# Altium project STB_ValidationBoard.PrjPcb (part 2 of 2)

## Sheet STB_UID.SchDoc: STB Validation Board - UID
size A4; Author: mayerph; DrawnBy: mayerph; Organization: PBL; Revision: A; SheetNumber: 4; SheetTotal: 4
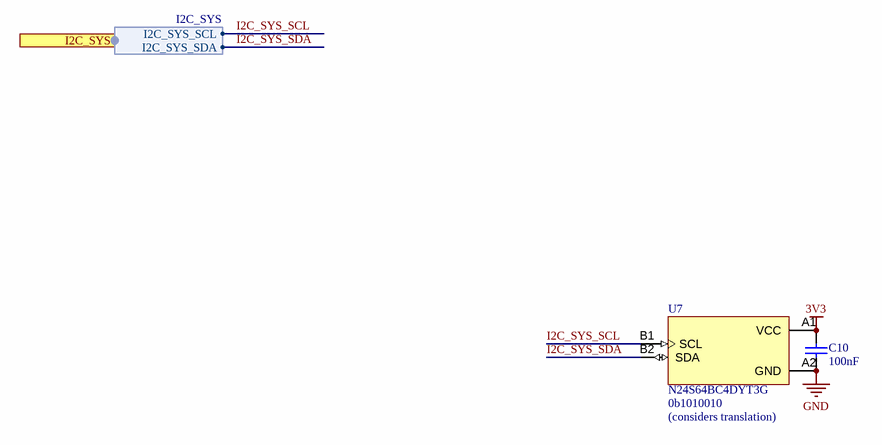
[diagram p2: STB_UID.SchDoc]

### Parts
C10  100nF  [CAPC1050X55X23LL05T13]
U7  N24S64BC4DYT3G  [4-WLCSP (0.77x0.77)]

### Ports
I2C_SYS (harness I2C_SYS, see STB_ValidationBoard[6A], STB_Sensors[1A], STB_Spectrometer[1B])

### Harnesses
I2C_SYS: I2C_SYS_SDA, I2C_SYS_SCL

### Nets
3V3: C10.2 U7.A1(VCC)
GND: C10.1 U7.A2(GND)
I2C_SYS_SCL: U7.B1(SCL) ; port I2C_SYS.I2C_SYS_SCL
I2C_SYS_SDA: U7.B2(SDA) ; port I2C_SYS.I2C_SYS_SDA

### Notes on the sheet
- (near U7) 0b1010010
- (considers translation)
- 1
- 2
- 3
- 4
- A
- B
- C
- Project:
- D
- Date:
- Drawing number:
- Rev:
- Format:
- A4 Q
- Drawn by:
- Laboratory:
- Page
- Sheet:
- of
- File:

### Library data of the parts
C10 = CMP-2000-05439-1: Chip Capacitor, 100 nF, +/- 10%, 16 V, -55 to 125 degC, 0402 (1005 Metric), RoHS, Tape and Reel; Manufacturer: Samsung Electro-Mechanics; Manufacturer Part Number: CL05B104KO5NNNC; Dielectric: X7R; Rated Voltage: 16V; Dielectric Material: Ceramic; Multilayer: Yes; Case Size/Dimension: 0402; Tolerance (%): ±10%; Value: 100nF; Manufacturer URL: http://www.samsungsem.com/global/index.jsp; Datasheet URL: https://datasheet.ciiva.com/29198/458718-da-01-en-vs-kondensator-0402-29198423.pdf; Datasheet Version: Nov-10; Supplier 1: Digi-Key; Supplier Part Number 1: 1276-1001-6-ND; RoHS: Yes; Category: Ceramic Capacitors; Stock 1: 24854634; Pricing 1: 1=0.10000, 10=0.02400, 50=0.01300, 100=0.01050, 500=0.00752, 1000=0.00592, 2500=0.00538, 5000=0.00495 (USD); Mount: Surface Mount; Number of Pins: 2; Package Shape: Rectangular; Size Code: 0402; Terminal Finish: Nickel; Min Operating Temperature: -55°C; Max Operating Temperature: 125°C; JESD-609 Code: e3; Capacitor Type: Ceramic; Negative Tolerance: 10%; Packaging: Tape and Reel; Positive Tolerance: 10%; Rated DC Voltage (URdc): 16V; Temperature Characteristics Code: X7R; Termination: Wraparound; Package Style: SMTMeter; Length: 1mm; Width: 0.5mm; Height: 0.55mm; REACH SVHC: Yes; RoHS Compliant: Yes; ComponentLink1URL: https://datasheet.ciiva.com:443/pdfs/VipMasterIC/IC/SEMS/SEMS-S-A0008384515/SEMS-S-A0008872921-1.pdf?src-supplier=IHS+Markit; ComponentLink1Description: https://datasheet.ciiva.com:443/pdfs/VipMasterIC/IC/SEMS/SEMS-S-A0008384515/SEMS-S-A0008872921-1.pdf?src-supplier=IHS+Markit; ComponentLink2URL: https://datasheet.ciiva.com/26920/getdatasheetpartid-359683-26920169.pdf?src-supplier=Verical; ComponentLink2Description: https://datasheet.ciiva.com/26920/getdatasheetpartid-359683-26920169.pdf?src-supplier=Verical; ComponentLink3URL: https://datasheet.ciiva.com/29198/458718-da-01-en-vs-kondensator-0402-29198423.pdf?src-supplier=Conrad; ComponentLink3Description: https://datasheet.ciiva.com/29198/458718-da-01-en-vs-kondensator-0402-29198423.pdf?src-supplier=Conrad; ComponentLink4URL: https://datasheet.ciiva.com/26309/mlcc-catalogdownload2013-eng-26309003.pdf?src-supplier=Distrelec; ComponentLink4Description: https://datasheet.ciiva.com/26309/mlcc-catalogdownload2013-eng-26309003.pdf?src-supplier=Distrelec; ComponentLink5URL: https://datasheet.ciiva.com/16208/cl05b104kq5nnnc-16208343.pdf?src-supplier=Future+Electronics; ComponentLink5Description: https://datasheet.ciiva.com/16208/cl05b104kq5nnnc-16208343.pdf?src-supplier=Future+Electronics
U7 = CMP-02089-1: Memory IC 64Kb (8K x 8) I²C 1 MHz 400 ns 4-WLCSP (0.77x0.77); Mfr: onsemi; Manufacturer: ON Semiconductor; Product Status: Active; Memory Type: Non-Volatile; Memory Format: EEPROM; Clock Frequency: 1 MHz; Write Cycle Time - Word, Page: 5ms; Access Time: 400 ns; Voltage - Supply: 1.7V ~ 5.5V; Base Product Number: N24S64; Technology: -; Memory Size: 64Kb (8K x 8); Memory Interface: I²C; Operating Temperature: -40°C ~ 85°C (TA); Mounting Type: Surface Mount; Package / Case: 4-XFBGA, WLCSP; Supplier Device Package: 4-WLCSP (0.77x0.77); Supplier 1: Digi-Key; Supplier Part Number 1: 488-N24S64BC4DYT3GDKR-ND; Manufacturer Part Number: N24S64BC4DYT3G; RoHS: Yes; Category: EEPROM

## Sheet STB_Sensors.SchDoc: STB Validation Board - Sensor
size A4; Author: mayerph; DrawnBy: mayerph; Organization: PBL; Revision: A; SheetNumber: 2; SheetTotal: 4
Used 64 times, as channels S1, S2, S3, S4, S5, S6, S7, S8, S9, S10, S11, S12, S13, S14, S15, S16, S17, S18, S19, S20, S21, S22, S23, S24, S25, S26, S27, S28, S29, S30, S31, S32, S33, S34, S35, S36, S37, S38, S39, S40, S41, S42, S43, S44, S45, S46, S47, S48, S49, S50, S51, S52, S53, S54, S55, S56, S57, S58, S59, S60, S61, S62, S63, S64. Parts and nets are listed once, with the designators drawn on the sheet.
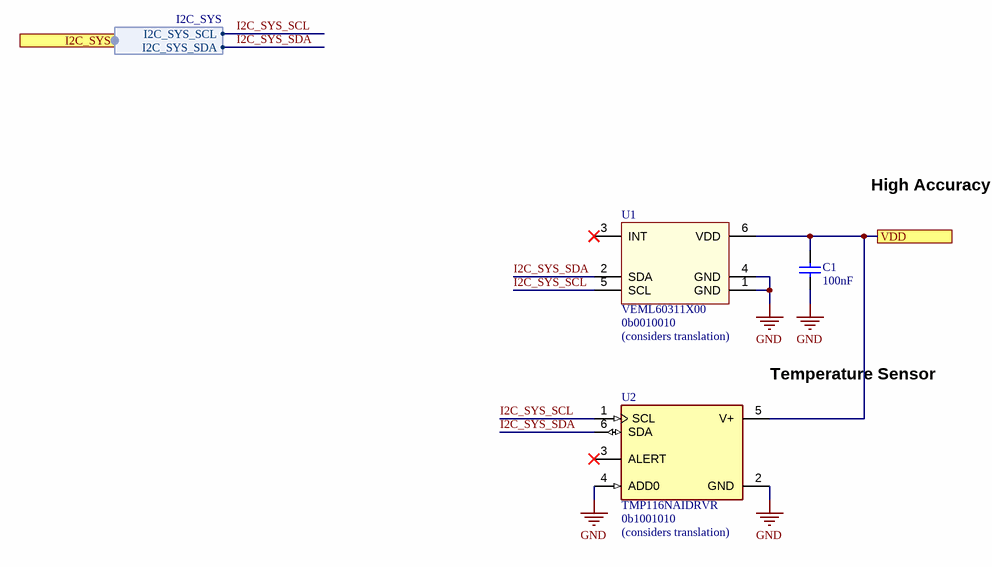
[diagram p3: STB_Sensors.SchDoc]

### Parts
C1  100nF  [CAPC1050X55X23LL05T13]
U1  VEML60311X00  [6-SMD - No Thermal Pad_2]
U2  TMP116NAIDRVR  Address: 0b1001010  [FP-DRV0006B-MFG]

### Ports
I2C_SYS (harness I2C_SYS, see STB_ValidationBoard[6B], STB_Spectrometer[1B], STB_UID[1A]), VDD (see STB_ValidationBoard[6B])

### Harnesses
I2C_SYS: I2C_SYS_SDA, I2C_SYS_SCL

### Nets
GND: C1.1 U1.1(GND) U1.4(GND) U2.2(GND) U2.4(ADD0)
I2C_SYS_SCL: U1.5(SCL) U2.1(SCL) ; port I2C_SYS.I2C_SYS_SCL
I2C_SYS_SDA: U1.2(SDA) U2.6(SDA) ; port I2C_SYS.I2C_SYS_SDA
VDD: C1.2 U1.6(VDD) U2.5(V+) ; port VDD

Not connected (* = marked no-connect by the designer): U1 3(INT)*; U2 3(ALERT)*

### Channels
S1: designators end in _S1; ports VDD=VDD1
S2: designators end in _S2; ports VDD=VDD2
S3: designators end in _S3; ports VDD=VDD3
S4: designators end in _S4; ports VDD=VDD4
S5: designators end in _S5; ports VDD=VDD5
S6: designators end in _S6; ports VDD=VDD6
S7: designators end in _S7; ports VDD=VDD7
S8: designators end in _S8; ports VDD=VDD8
S9: designators end in _S9; ports VDD=VDD9
S10: designators end in _S10; ports VDD=VDD10
S11: designators end in _S11; ports VDD=VDD11
S12: designators end in _S12; ports VDD=VDD12
S13: designators end in _S13; ports VDD=VDD13
S14: designators end in _S14; ports VDD=VDD14
S15: designators end in _S15; ports VDD=VDD15
S16: designators end in _S16; ports VDD=VDD16
S17: designators end in _S17; ports VDD=VDD17
S18: designators end in _S18; ports VDD=VDD18
S19: designators end in _S19; ports VDD=VDD19
S20: designators end in _S20; ports VDD=VDD20
S21: designators end in _S21; ports VDD=VDD21
S22: designators end in _S22; ports VDD=VDD22
S23: designators end in _S23; ports VDD=VDD23
S24: designators end in _S24; ports VDD=VDD24
S25: designators end in _S25; ports VDD=VDD25
S26: designators end in _S26; ports VDD=VDD26
S27: designators end in _S27; ports VDD=VDD27
S28: designators end in _S28; ports VDD=VDD28
S29: designators end in _S29; ports VDD=VDD29
S30: designators end in _S30; ports VDD=VDD30
S31: designators end in _S31; ports VDD=VDD31
S32: designators end in _S32; ports VDD=VDD32
S33: designators end in _S33; ports VDD=VDD33
S34: designators end in _S34; ports VDD=VDD34
S35: designators end in _S35; ports VDD=VDD35
S36: designators end in _S36; ports VDD=VDD36
S37: designators end in _S37; ports VDD=VDD37
S38: designators end in _S38; ports VDD=VDD38
S39: designators end in _S39; ports VDD=VDD39
S40: designators end in _S40; ports VDD=VDD40
S41: designators end in _S41; ports VDD=VDD41
S42: designators end in _S42; ports VDD=VDD42
S43: designators end in _S43; ports VDD=VDD43
S44: designators end in _S44; ports VDD=VDD44
S45: designators end in _S45; ports VDD=VDD45
S46: designators end in _S46; ports VDD=VDD46
S47: designators end in _S47; ports VDD=VDD47
S48: designators end in _S48; ports VDD=VDD48
S49: designators end in _S49; ports VDD=VDD49
S50: designators end in _S50; ports VDD=VDD50
S51: designators end in _S51; ports VDD=VDD51
S52: designators end in _S52; ports VDD=VDD52
S53: designators end in _S53; ports VDD=VDD53
S54: designators end in _S54; ports VDD=VDD54
S55: designators end in _S55; ports VDD=VDD55
S56: designators end in _S56; ports VDD=VDD56
S57: designators end in _S57; ports VDD=VDD57
S58: designators end in _S58; ports VDD=VDD58
S59: designators end in _S59; ports VDD=VDD59
S60: designators end in _S60; ports VDD=VDD60
S61: designators end in _S61; ports VDD=VDD61
S62: designators end in _S62; ports VDD=VDD62
S63: designators end in _S63; ports VDD=VDD63
S64: designators end in _S64; ports VDD=VDD64

### Notes on the sheet
- (near U1) High Accuracy Ambient Light Sensor with IR
- (near U1) 0b0010010
- (near U1) (considers translation)
- (near U2) Temperature Sensor
- (near U2) (considers translation)
- 1
- 2
- 3
- 4
- A
- B
- C
- Project:
- D
- Date:
- Drawing number:
- Rev:
- Format:
- A4 Q
- Drawn by:
- Laboratory:
- Page
- Sheet:
- of
- File:

### Library data of the parts
C1 = CMP-2000-05439-1: as C10 on sheet STB_UID; Case Size/Dimension: 0402; Tolerance (%): ±10%; Value: 100nF; Manufacturer URL: http://www.samsungsem.com/global/index.jsp; Datasheet URL: https://datasheet.ciiva.com/29198/458718-da-01-en-vs-kondensator-0402-29198423.pdf; Datasheet Version: Nov-10; Supplier 1: Digi-Key; Supplier Part Number 1: 1276-1001-6-ND; RoHS: Yes; Category: Ceramic Capacitors; Stock 1: 24854634; Pricing 1: 1=0.10000, 10=0.02400, 50=0.01300, 100=0.01050, 500=0.00752, 1000=0.00592, 2500=0.00538, 5000=0.00495 (USD); Mount: Surface Mount; Number of Pins: 2; Package Shape: Rectangular; Size Code: 0402; Terminal Finish: Nickel; Min Operating Temperature: -55°C; Max Operating Temperature: 125°C; JESD-609 Code: e3; Capacitor Type: Ceramic; Negative Tolerance: 10%; Packaging: Tape and Reel; Positive Tolerance: 10%; Rated DC Voltage (URdc): 16V; Temperature Characteristics Code: X7R; Termination: Wraparound; Package Style: SMTMeter; Length: 1mm; Width: 0.5mm; Height: 0.55mm; REACH SVHC: Yes; RoHS Compliant: Yes; ComponentLink1URL: https://datasheet.ciiva.com:443/pdfs/VipMasterIC/IC/SEMS/SEMS-S-A0008384515/SEMS-S-A0008872921-1.pdf?src-supplier=IHS+Markit; ComponentLink1Description: https://datasheet.ciiva.com:443/pdfs/VipMasterIC/IC/SEMS/SEMS-S-A0008384515/SEMS-S-A0008872921-1.pdf?src-supplier=IHS+Markit; ComponentLink2URL: https://datasheet.ciiva.com/26920/getdatasheetpartid-359683-26920169.pdf?src-supplier=Verical; ComponentLink2Description: https://datasheet.ciiva.com/26920/getdatasheetpartid-359683-26920169.pdf?src-supplier=Verical; ComponentLink3URL: https://datasheet.ciiva.com/29198/458718-da-01-en-vs-kondensator-0402-29198423.pdf?src-supplier=Conrad; ComponentLink3Description: https://datasheet.ciiva.com/29198/458718-da-01-en-vs-kondensator-0402-29198423.pdf?src-supplier=Conrad; ComponentLink4URL: https://datasheet.ciiva.com/26309/mlcc-catalogdownload2013-eng-26309003.pdf?src-supplier=Distrelec; ComponentLink4Description: https://datasheet.ciiva.com/26309/mlcc-catalogdownload2013-eng-26309003.pdf?src-supplier=Distrelec; ComponentLink5URL: https://datasheet.ciiva.com/16208/cl05b104kq5nnnc-16208343.pdf?src-supplier=Future+Electronics; ComponentLink5Description: https://datasheet.ciiva.com/16208/cl05b104kq5nnnc-16208343.pdf?src-supplier=Future+Electronics
U1 = CMP-02054-1: Ambient Light Sensor, I²C 6-SMD, No Lead; Mfr: Vishay Semiconductor Opto Division; Manufacturer: Vishay; Proximity Detection: Yes; Voltage - Supply: 2.5V ~ 3.6V; Series: -; Type: Ambient; Wavelength: -; Output Type: I²C; Operating Temperature: -40°C ~ 110°C (TA); Mounting Type: Surface Mount; Package / Case: 6-SMD, No Lead; Supplier Device Package: 6-SMD; Supplier 1: Farnell; Supplier Part Number 1: 3765835; Manufacturer Part Number: VEML60311X00; RoHS: No; Category: Uncategorized; Stock 1: 2982; Pricing 1: 1=3.35000, 10=2.44000, 25=2.28000, 50=2.16000 (GBP)
U2 = CMP-04948-000013-1: SENSOR DIGITAL -55C-125C 6WSON; Manufacturer: Texas Instruments; Sensor Output: I2C,SMBus; Max Junction Temp: +150°C; Standoff Height: 0mm; Min Supply Voltage: 1.9V; Max Supply Voltage: 5.5V; Resolution: 16bits; Operating Supply Current: 3.5-135uA; Package Shape/Style: Square; Accuracy-Max (Cel): 0.5°C; Number of Bits: 16; Output Interface Type: 2-Wire; Sensors/Transducers Type: TEMPERATURE SENSOR,SWITCH/DIGITAL OUTPUT,SERIAL; Body Breadth: 2inch; Body Height: 0.8mm; Body Length or Diameter: 2mm; Manufacturer Part Number: TMP116NAIDRVR; Temperature Range Low: -55°C; Temperature: -55°C to +125°C; Ipc Land Pattern Name: DFN200X200X80-6; Device Class L1: Sensors; Package: DRV0006B; Interface: I2C,SMBus; Device Class L3: unset; Ambient Temperature Range Low: -55°C; Lead Free: Yes; Height: 0.8mm; Temperature Range High: +125°C; Digikey Description: SENSOR DIGITAL -55C-125C 6WSON; RoHS: TRUE; Mouser Description: ±0.2°C Accurate Digital Temperature Sensor With NV Memory 6-WSON -55 to 125; Ambient Temperature Range High: +150°C; ComponentLink2Description: Datasheet; Category: IC; Device Class L2: Temperature and Humidity Sensors; ComponentLink2URL: https://www.ti.com/lit/ds/symlink/tmp116.pdf; Octopart: https://octopart.com/tmp116naidrvr-texas+instruments-82367758; Automotive: No; Supplier 1: Digi-Key; Supplier Part Number 1: 296-48306-6-ND; Stock 1: 6627; Pricing 1: 1=2.48000, 10=2.22500, 25=2.09880, 100=1.78820, 250=1.67904, 500=1.46916, 1000=1.26720 (USD); Mount: Surface Mount; Housing Material: Plastic; Terminal Finish: Nickel; Min Operating Temperature: -55°C; Max Operating Temperature: 150°C; JESD-609 Code: e4; Termination: Solder; REACH SVHC: Yes; RoHS Compliant: Yes; ComponentLink1URL: https://www.ti.com:443/lit/ds/symlink/tmp116.pdf?src-supplier=IHS+Markit; ComponentLink1Description: https://www.ti.com:443/lit/ds/symlink/tmp116.pdf?src-supplier=IHS+Markit; ComponentLink3URL: http://www.ti.com/lit/ds/symlink/tmp116.pdf?src-supplier=Digi-Key; ComponentLink3Description: http://www.ti.com/lit/ds/symlink/tmp116.pdf?src-supplier=Digi-Key

## Nets that join several sheets
3V3: STB_ValidationBoard (25 pins), STB_Spectrometer (23 pins), STB_UID (C10.2 U7.A1)
GND: STB_ValidationBoard (40 pins), STB_Spectrometer (16 pins), STB_UID (C10.1 U7.A2), S1 (5 pins), S2 (5 pins), S3 (5 pins), S4 (5 pins), S5 (5 pins), S6 (5 pins), S7 (5 pins), S8 (5 pins), S9 (5 pins), S10 (5 pins), S11 (5 pins), S12 (5 pins), S13 (5 pins), S14 (5 pins), S15 (5 pins), S16 (5 pins), S17 (5 pins), S18 (5 pins), S19 (5 pins), S20 (5 pins), S21 (5 pins), S22 (5 pins), S23 (5 pins), S24 (5 pins), S25 (5 pins), S26 (5 pins), S27 (5 pins), S28 (5 pins), S29 (5 pins), S30 (5 pins), S31 (5 pins), S32 (5 pins), S33 (5 pins), S34 (5 pins), S35 (5 pins), S36 (5 pins), S37 (5 pins), S38 (5 pins), S39 (5 pins), S40 (5 pins), S41 (5 pins), S42 (5 pins), S43 (5 pins), S44 (5 pins), S45 (5 pins), S46 (5 pins), S47 (5 pins), S48 (5 pins), S49 (5 pins), S50 (5 pins), S51 (5 pins), S52 (5 pins), S53 (5 pins), S54 (5 pins), S55 (5 pins), S56 (5 pins), S57 (5 pins), S58 (5 pins), S59 (5 pins), S60 (5 pins), S61 (5 pins), S62 (5 pins), S63 (5 pins), S64 (5 pins)
I2C_SYS_SCL: STB_ValidationBoard (6 pins), STB_Spectrometer (U3.11), STB_UID (U7.B1), S1 (U1_S1.5 U2_S1.1), S2 (U1_S2.5 U2_S2.1), S3 (U1_S3.5 U2_S3.1), S4 (U1_S4.5 U2_S4.1), S5 (U1_S5.5 U2_S5.1), S6 (U1_S6.5 U2_S6.1), S7 (U1_S7.5 U2_S7.1), S8 (U1_S8.5 U2_S8.1), S9 (U1_S9.5 U2_S9.1), S10 (U1_S10.5 U2_S10.1), S11 (U1_S11.5 U2_S11.1), S12 (U1_S12.5 U2_S12.1), S13 (U1_S13.5 U2_S13.1), S14 (U1_S14.5 U2_S14.1), S15 (U1_S15.5 U2_S15.1), S16 (U1_S16.5 U2_S16.1), S17 (U1_S17.5 U2_S17.1), S18 (U1_S18.5 U2_S18.1), S19 (U1_S19.5 U2_S19.1), S20 (U1_S20.5 U2_S20.1), S21 (U1_S21.5 U2_S21.1), S22 (U1_S22.5 U2_S22.1), S23 (U1_S23.5 U2_S23.1), S24 (U1_S24.5 U2_S24.1), S25 (U1_S25.5 U2_S25.1), S26 (U1_S26.5 U2_S26.1), S27 (U1_S27.5 U2_S27.1), S28 (U1_S28.5 U2_S28.1), S29 (U1_S29.5 U2_S29.1), S30 (U1_S30.5 U2_S30.1), S31 (U1_S31.5 U2_S31.1), S32 (U1_S32.5 U2_S32.1), S33 (U1_S33.5 U2_S33.1), S34 (U1_S34.5 U2_S34.1), S35 (U1_S35.5 U2_S35.1), S36 (U1_S36.5 U2_S36.1), S37 (U1_S37.5 U2_S37.1), S38 (U1_S38.5 U2_S38.1), S39 (U1_S39.5 U2_S39.1), S40 (U1_S40.5 U2_S40.1), S41 (U1_S41.5 U2_S41.1), S42 (U1_S42.5 U2_S42.1), S43 (U1_S43.5 U2_S43.1), S44 (U1_S44.5 U2_S44.1), S45 (U1_S45.5 U2_S45.1), S46 (U1_S46.5 U2_S46.1), S47 (U1_S47.5 U2_S47.1), S48 (U1_S48.5 U2_S48.1), S49 (U1_S49.5 U2_S49.1), S50 (U1_S50.5 U2_S50.1), S51 (U1_S51.5 U2_S51.1), S52 (U1_S52.5 U2_S52.1), S53 (U1_S53.5 U2_S53.1), S54 (U1_S54.5 U2_S54.1), S55 (U1_S55.5 U2_S55.1), S56 (U1_S56.5 U2_S56.1), S57 (U1_S57.5 U2_S57.1), S58 (U1_S58.5 U2_S58.1), S59 (U1_S59.5 U2_S59.1), S60 (U1_S60.5 U2_S60.1), S61 (U1_S61.5 U2_S61.1), S62 (U1_S62.5 U2_S62.1), S63 (U1_S63.5 U2_S63.1), S64 (U1_S64.5 U2_S64.1)
I2C_SYS_SDA: STB_ValidationBoard (6 pins), STB_Spectrometer (U3.12), STB_UID (U7.B2), S1 (U1_S1.2 U2_S1.6), S2 (U1_S2.2 U2_S2.6), S3 (U1_S3.2 U2_S3.6), S4 (U1_S4.2 U2_S4.6), S5 (U1_S5.2 U2_S5.6), S6 (U1_S6.2 U2_S6.6), S7 (U1_S7.2 U2_S7.6), S8 (U1_S8.2 U2_S8.6), S9 (U1_S9.2 U2_S9.6), S10 (U1_S10.2 U2_S10.6), S11 (U1_S11.2 U2_S11.6), S12 (U1_S12.2 U2_S12.6), S13 (U1_S13.2 U2_S13.6), S14 (U1_S14.2 U2_S14.6), S15 (U1_S15.2 U2_S15.6), S16 (U1_S16.2 U2_S16.6), S17 (U1_S17.2 U2_S17.6), S18 (U1_S18.2 U2_S18.6), S19 (U1_S19.2 U2_S19.6), S20 (U1_S20.2 U2_S20.6), S21 (U1_S21.2 U2_S21.6), S22 (U1_S22.2 U2_S22.6), S23 (U1_S23.2 U2_S23.6), S24 (U1_S24.2 U2_S24.6), S25 (U1_S25.2 U2_S25.6), S26 (U1_S26.2 U2_S26.6), S27 (U1_S27.2 U2_S27.6), S28 (U1_S28.2 U2_S28.6), S29 (U1_S29.2 U2_S29.6), S30 (U1_S30.2 U2_S30.6), S31 (U1_S31.2 U2_S31.6), S32 (U1_S32.2 U2_S32.6), S33 (U1_S33.2 U2_S33.6), S34 (U1_S34.2 U2_S34.6), S35 (U1_S35.2 U2_S35.6), S36 (U1_S36.2 U2_S36.6), S37 (U1_S37.2 U2_S37.6), S38 (U1_S38.2 U2_S38.6), S39 (U1_S39.2 U2_S39.6), S40 (U1_S40.2 U2_S40.6), S41 (U1_S41.2 U2_S41.6), S42 (U1_S42.2 U2_S42.6), S43 (U1_S43.2 U2_S43.6), S44 (U1_S44.2 U2_S44.6), S45 (U1_S45.2 U2_S45.6), S46 (U1_S46.2 U2_S46.6), S47 (U1_S47.2 U2_S47.6), S48 (U1_S48.2 U2_S48.6), S49 (U1_S49.2 U2_S49.6), S50 (U1_S50.2 U2_S50.6), S51 (U1_S51.2 U2_S51.6), S52 (U1_S52.2 U2_S52.6), S53 (U1_S53.2 U2_S53.6), S54 (U1_S54.2 U2_S54.6), S55 (U1_S55.2 U2_S55.6), S56 (U1_S56.2 U2_S56.6), S57 (U1_S57.2 U2_S57.6), S58 (U1_S58.2 U2_S58.6), S59 (U1_S59.2 U2_S59.6), S60 (U1_S60.2 U2_S60.6), S61 (U1_S61.2 U2_S61.6), S62 (U1_S62.2 U2_S62.6), S63 (U1_S63.2 U2_S63.6), S64 (U1_S64.2 U2_S64.6)
VDD1: STB_ValidationBoard (U9.1), S1 (C1_S1.2 U1_S1.6 U2_S1.5)
VDD2: STB_ValidationBoard (U9.2), S2 (C1_S2.2 U1_S2.6 U2_S2.5)
VDD3: STB_ValidationBoard (U9.3), S3 (C1_S3.2 U1_S3.6 U2_S3.5)
VDD4: STB_ValidationBoard (U9.4), S4 (C1_S4.2 U1_S4.6 U2_S4.5)
VDD5: STB_ValidationBoard (U9.5), S5 (C1_S5.2 U1_S5.6 U2_S5.5)
VDD6: STB_ValidationBoard (U9.6), S6 (C1_S6.2 U1_S6.6 U2_S6.5)
VDD7: STB_ValidationBoard (U9.7), S7 (C1_S7.2 U1_S7.6 U2_S7.5)
VDD8: STB_ValidationBoard (U9.8), S8 (C1_S8.2 U1_S8.6 U2_S8.5)
VDD9: STB_ValidationBoard (U9.10), S9 (C1_S9.2 U1_S9.6 U2_S9.5)
VDD10: STB_ValidationBoard (U9.11), S10 (C1_S10.2 U1_S10.6 U2_S10.5)
VDD11: STB_ValidationBoard (U9.12), S11 (C1_S11.2 U1_S11.6 U2_S11.5)
VDD12: STB_ValidationBoard (U9.13), S12 (C1_S12.2 U1_S12.6 U2_S12.5)
VDD13: STB_ValidationBoard (U9.14), S13 (C1_S13.2 U1_S13.6 U2_S13.5)
VDD14: STB_ValidationBoard (U9.15), S14 (C1_S14.2 U1_S14.6 U2_S14.5)
VDD15: STB_ValidationBoard (U9.16), S15 (C1_S15.2 U1_S15.6 U2_S15.5)
VDD16: STB_ValidationBoard (U9.17), S16 (C1_S16.2 U1_S16.6 U2_S16.5)
VDD17: STB_ValidationBoard (U11.1), S17 (C1_S17.2 U1_S17.6 U2_S17.5)
VDD18: STB_ValidationBoard (U11.2), S18 (C1_S18.2 U1_S18.6 U2_S18.5)
VDD19: STB_ValidationBoard (U11.3), S19 (C1_S19.2 U1_S19.6 U2_S19.5)
VDD20: STB_ValidationBoard (U11.4), S20 (C1_S20.2 U1_S20.6 U2_S20.5)
VDD21: STB_ValidationBoard (U11.5), S21 (C1_S21.2 U1_S21.6 U2_S21.5)
VDD22: STB_ValidationBoard (U11.6), S22 (C1_S22.2 U1_S22.6 U2_S22.5)
VDD23: STB_ValidationBoard (U11.7), S23 (C1_S23.2 U1_S23.6 U2_S23.5)
VDD24: STB_ValidationBoard (U11.8), S24 (C1_S24.2 U1_S24.6 U2_S24.5)
VDD25: STB_ValidationBoard (U11.10), S25 (C1_S25.2 U1_S25.6 U2_S25.5)
VDD26: STB_ValidationBoard (U11.11), S26 (C1_S26.2 U1_S26.6 U2_S26.5)
VDD27: STB_ValidationBoard (U11.12), S27 (C1_S27.2 U1_S27.6 U2_S27.5)
VDD28: STB_ValidationBoard (U11.13), S28 (C1_S28.2 U1_S28.6 U2_S28.5)
VDD29: STB_ValidationBoard (U11.14), S29 (C1_S29.2 U1_S29.6 U2_S29.5)
VDD30: STB_ValidationBoard (U11.15), S30 (C1_S30.2 U1_S30.6 U2_S30.5)
VDD31: STB_ValidationBoard (U11.16), S31 (C1_S31.2 U1_S31.6 U2_S31.5)
VDD32: STB_ValidationBoard (U11.17), S32 (C1_S32.2 U1_S32.6 U2_S32.5)
VDD33: STB_ValidationBoard (U10.1), S33 (C1_S33.2 U1_S33.6 U2_S33.5)
VDD34: STB_ValidationBoard (U10.2), S34 (C1_S34.2 U1_S34.6 U2_S34.5)
VDD35: STB_ValidationBoard (U10.3), S35 (C1_S35.2 U1_S35.6 U2_S35.5)
VDD36: STB_ValidationBoard (U10.4), S36 (C1_S36.2 U1_S36.6 U2_S36.5)
VDD37: STB_ValidationBoard (U10.5), S37 (C1_S37.2 U1_S37.6 U2_S37.5)
VDD38: STB_ValidationBoard (U10.6), S38 (C1_S38.2 U1_S38.6 U2_S38.5)
VDD39: STB_ValidationBoard (U10.7), S39 (C1_S39.2 U1_S39.6 U2_S39.5)
VDD40: STB_ValidationBoard (U10.8), S40 (C1_S40.2 U1_S40.6 U2_S40.5)
VDD41: STB_ValidationBoard (U10.10), S41 (C1_S41.2 U1_S41.6 U2_S41.5)
VDD42: STB_ValidationBoard (U10.11), S42 (C1_S42.2 U1_S42.6 U2_S42.5)
VDD43: STB_ValidationBoard (U10.12), S43 (C1_S43.2 U1_S43.6 U2_S43.5)
VDD44: STB_ValidationBoard (U10.13), S44 (C1_S44.2 U1_S44.6 U2_S44.5)
VDD45: STB_ValidationBoard (U10.14), S45 (C1_S45.2 U1_S45.6 U2_S45.5)
VDD46: STB_ValidationBoard (U10.15), S46 (C1_S46.2 U1_S46.6 U2_S46.5)
VDD47: STB_ValidationBoard (U10.16), S47 (C1_S47.2 U1_S47.6 U2_S47.5)
VDD48: STB_ValidationBoard (U10.17), S48 (C1_S48.2 U1_S48.6 U2_S48.5)
VDD49: STB_ValidationBoard (U12.1), S49 (C1_S49.2 U1_S49.6 U2_S49.5)
VDD50: STB_ValidationBoard (U12.2), S50 (C1_S50.2 U1_S50.6 U2_S50.5)
VDD51: STB_ValidationBoard (U12.3), S51 (C1_S51.2 U1_S51.6 U2_S51.5)
VDD52: STB_ValidationBoard (U12.4), S52 (C1_S52.2 U1_S52.6 U2_S52.5)
VDD53: STB_ValidationBoard (U12.5), S53 (C1_S53.2 U1_S53.6 U2_S53.5)
VDD54: STB_ValidationBoard (U12.6), S54 (C1_S54.2 U1_S54.6 U2_S54.5)
VDD55: STB_ValidationBoard (U12.7), S55 (C1_S55.2 U1_S55.6 U2_S55.5)
VDD56: STB_ValidationBoard (U12.8), S56 (C1_S56.2 U1_S56.6 U2_S56.5)
VDD57: STB_ValidationBoard (U12.10), S57 (C1_S57.2 U1_S57.6 U2_S57.5)
VDD58: STB_ValidationBoard (U12.11), S58 (C1_S58.2 U1_S58.6 U2_S58.5)
VDD59: STB_ValidationBoard (U12.12), S59 (C1_S59.2 U1_S59.6 U2_S59.5)
VDD60: STB_ValidationBoard (U12.13), S60 (C1_S60.2 U1_S60.6 U2_S60.5)
VDD61: STB_ValidationBoard (U12.14), S61 (C1_S61.2 U1_S61.6 U2_S61.5)
VDD62: STB_ValidationBoard (U12.15), S62 (C1_S62.2 U1_S62.6 U2_S62.5)
VDD63: STB_ValidationBoard (U12.16), S63 (C1_S63.2 U1_S63.6 U2_S63.5)
VDD64: STB_ValidationBoard (U12.17), S64 (C1_S64.2 U1_S64.6 U2_S64.5)

## Assembly variants
STB_ValidationBoard_main: not fitted R2 R3 SW1